# Altium project PortSwitcherPCB1D.PrjPCB
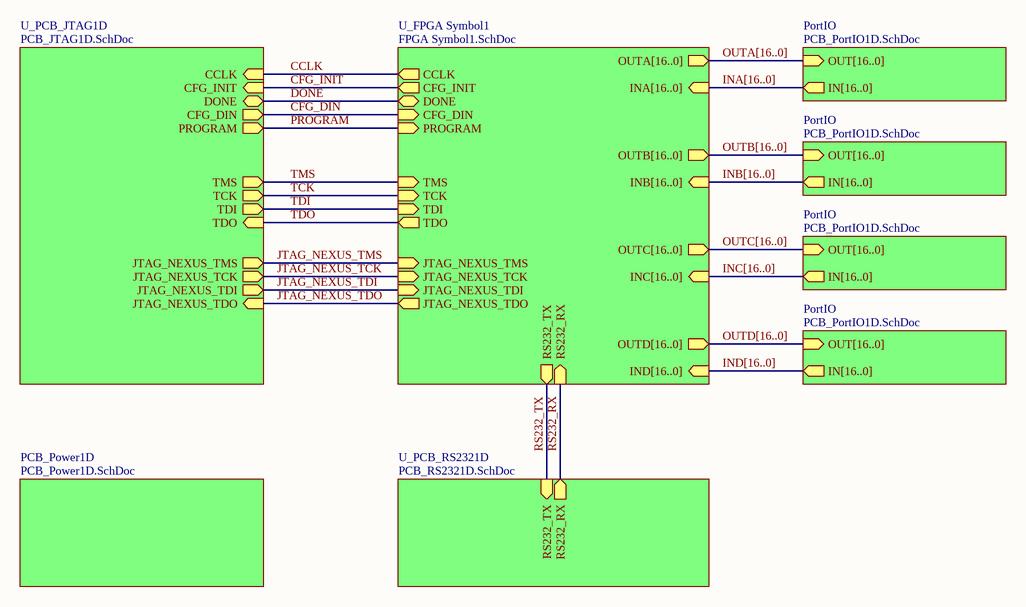
[diagram p0: PCB_PortSwitcher1D.SchDoc]
7 sheets, 152 parts. Net scope: hierarchical (ports join the sheet entries above them; power ports are global).
Board file: PortSwitcher1D.PCBDOC
Sheets:
  PCB_PortSwitcher1D.SchDoc
    PCB_Power1D = PCB_Power1D.SchDoc
    U_PCB_JTAG1D = PCB_JTAG1D.SchDoc
    PortIO = PCB_PortIO1D.SchDoc
    PortIO = PCB_PortIO1D.SchDoc
    PortIO = PCB_PortIO1D.SchDoc
    PortIO = PCB_PortIO1D.SchDoc
    U_FPGA Symbol1 = FPGA Symbol1.SchDoc
      U_FPGA Sheet1 = FPGA Sheet1.SchDoc
    U_PCB_RS2321D = PCB_RS2321D.SchDoc

## Sheet PCB_PortSwitcher1D.SchDoc
size A4; Organization: Altium Limited; Address1: L3, 12a Rodborough Rd; Address2: Frenchs Forest; Address3: NSW; Address4: Australia 2086; DocumentNumber: 1; SheetNumber: 1; SheetTotal: 7

### Sub-sheets
PCB_Power1D = PCB_Power1D.SchDoc: no entries
PortIO = PCB_PortIO1D.SchDoc: OUT[16..0] (in), IN[16..0] (out)
PortIO = PCB_PortIO1D.SchDoc: OUT[16..0] (in), IN[16..0] (out)
PortIO = PCB_PortIO1D.SchDoc: OUT[16..0] (in), IN[16..0] (out)
PortIO = PCB_PortIO1D.SchDoc: OUT[16..0] (in), IN[16..0] (out)
U_FPGA Symbol1 = FPGA Symbol1.SchDoc: CFG_INIT (out), CFG_DIN (in), PROGRAM (in), DONE (bidir), CCLK (out), TMS (in), TCK (in), TDI (in), JTAG_NEXUS_TMS (in), JTAG_NEXUS_TCK (in), JTAG_NEXUS_TDI (in), JTAG_NEXUS_TDO (out), TDO (out), OUTD[16..0] (out), OUTC[16..0] (out), OUTB[16..0] (out), OUTA[16..0] (out), IND[16..0] (in), INC[16..0] (in), INB[16..0] (in), INA[16..0] (in), RS232_TX (out), RS232_RX (in)
U_PCB_JTAG1D = PCB_JTAG1D.SchDoc: TDO (in), TDI (out), TCK (out), TMS (out), DONE (bidir), PROGRAM (out), CCLK (in), JTAG_NEXUS_TMS (out), JTAG_NEXUS_TCK (out), JTAG_NEXUS_TDI (out), JTAG_NEXUS_TDO (in), CFG_DIN (out), CFG_INIT (in)
U_PCB_RS2321D = PCB_RS2321D.SchDoc: RS232_RX (out), RS232_TX (in)

### Nets
CCLK: sheet U_PCB_JTAG1D/CCLK, sheet U_FPGA Symbol1/CCLK
CFG_DIN: sheet U_PCB_JTAG1D/CFG_DIN, sheet U_FPGA Symbol1/CFG_DIN
CFG_INIT: sheet U_PCB_JTAG1D/CFG_INIT, sheet U_FPGA Symbol1/CFG_INIT
DONE: sheet U_PCB_JTAG1D/DONE, sheet U_FPGA Symbol1/DONE
JTAG_NEXUS_TCK: sheet U_PCB_JTAG1D/JTAG_NEXUS_TCK, sheet U_FPGA Symbol1/JTAG_NEXUS_TCK
JTAG_NEXUS_TDI: sheet U_PCB_JTAG1D/JTAG_NEXUS_TDI, sheet U_FPGA Symbol1/JTAG_NEXUS_TDI
JTAG_NEXUS_TDO: sheet U_PCB_JTAG1D/JTAG_NEXUS_TDO, sheet U_FPGA Symbol1/JTAG_NEXUS_TDO
JTAG_NEXUS_TMS: sheet U_PCB_JTAG1D/JTAG_NEXUS_TMS, sheet U_FPGA Symbol1/JTAG_NEXUS_TMS
PROGRAM: sheet U_PCB_JTAG1D/PROGRAM, sheet U_FPGA Symbol1/PROGRAM
RS232_RX: sheet U_FPGA Symbol1/RS232_RX, sheet U_PCB_RS2321D/RS232_RX
RS232_TX: sheet U_FPGA Symbol1/RS232_TX, sheet U_PCB_RS2321D/RS232_TX
TCK: sheet U_PCB_JTAG1D/TCK, sheet U_FPGA Symbol1/TCK
TDI: sheet U_PCB_JTAG1D/TDI, sheet U_FPGA Symbol1/TDI
TDO: sheet U_PCB_JTAG1D/TDO, sheet U_FPGA Symbol1/TDO
TMS: sheet U_PCB_JTAG1D/TMS, sheet U_FPGA Symbol1/TMS

### Buses and harness runs
bus INA[16..0] = sheet PortIO/IN[16..0] = sheet U_FPGA Symbol1/INA[16..0]
bus INB[16..0] = sheet PortIO/IN[16..0] = sheet U_FPGA Symbol1/INB[16..0]
bus INC[16..0] = sheet PortIO/IN[16..0] = sheet U_FPGA Symbol1/INC[16..0]
bus IND[16..0] = sheet PortIO/IN[16..0] = sheet U_FPGA Symbol1/IND[16..0]
bus OUTA[16..0] = sheet PortIO/OUT[16..0] = sheet U_FPGA Symbol1/OUTA[16..0]
bus OUTB[16..0] = sheet PortIO/OUT[16..0] = sheet U_FPGA Symbol1/OUTB[16..0]
bus OUTC[16..0] = sheet PortIO/OUT[16..0] = sheet U_FPGA Symbol1/OUTC[16..0]
bus OUTD[16..0] = sheet PortIO/OUT[16..0] = sheet U_FPGA Symbol1/OUTD[16..0]

### Notes on the sheet
- Title
- Size:
- Date:
- A4
- Number:
- Time:
- Revision:
- Sheet
- of
- File:

## Sheet PCB_Power1D.SchDoc
size A4; Organization: Altium Limited; Address1: L3, 12a Rodborough Rd; Address2: Frenchs Forest; Address3: NSW; Address4: Australia 2086; DocumentNumber: 2; SheetNumber: 2; SheetTotal: 7
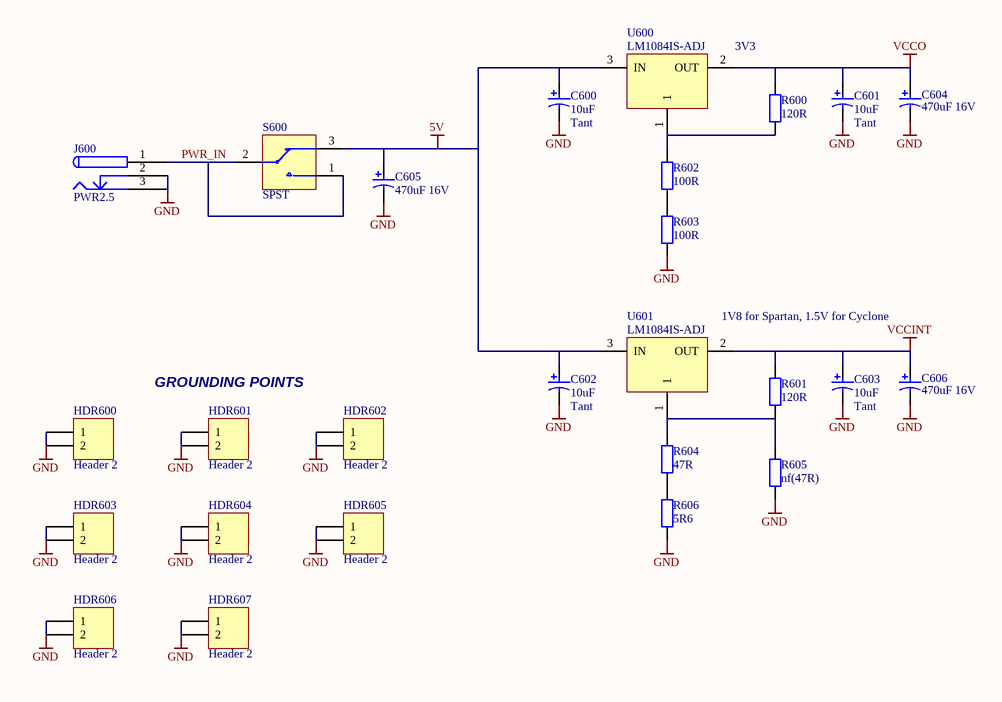
[diagram p1: PCB_Power1D.SchDoc]

### Parts
C600  10uF  Capacitor Type: Tant  [MCCT-B]
C601  10uF  Capacitor Type: Tant  [MCCT-B]
C602  10uF  Capacitor Type: Tant  [MCCT-B]
C603  10uF  Capacitor Type: Tant  [MCCT-B]
C604  470uF 16V  [RB8/3.5]
C605  470uF 16V  [RB8/3.5]
C606  470uF 16V  [RB8/3.5]
HDR600  Header 2  [HDR1X2]
HDR601  Header 2  [HDR1X2]
HDR602  Header 2  [HDR1X2]
HDR603  Header 2  [HDR1X2]
HDR604  Header 2  [HDR1X2]
HDR605  Header 2  [HDR1X2]
HDR606  Header 2  [HDR1X2]
HDR607  Header 2  [HDR1X2]
J600  PWR2.5  [PWR2.5]
R600  120R  [CC2012-0805]
R601  120R  [CC2012-0805]
R602  100R  [CC2012-0805]
R603  100R  [CC2012-0805]
R604  47R  [CC2012-0805]
R605  nf(47R)  [CC2012-0805]
R606  5R6  [CC2012-0805]
S600  SPST  [PCB_SWITCH]
U600  LM1084IS-ADJ  [TO-263]
U601  LM1084IS-ADJ  [TO-263]

### Nets
5V: C600.1 C602.1 C605.1 S600.3 U600.3(IN) U601.3(IN)
GND: C600.2 C601.2 C602.2 C603.2 C604.2 C605.2 C606.2 HDR600.1 HDR600.2 HDR601.1 HDR601.2 HDR602.1 HDR602.2 HDR603.1 HDR603.2 HDR604.1 HDR604.2 HDR605.1 HDR605.2 HDR606.1 HDR606.2 HDR607.1 HDR607.2 J600.2 J600.3 R603.1 R605.1 R606.1
VCCINT: C603.1 C606.1 R601.2 U601.2(OUT)
VCCO: C601.1 C604.1 R600.2 U600.2(OUT)
PWR_IN: J600.1 S600.1 S600.2
NetR600_1: R600.1 R602.2 U600.1
NetR601_1: R601.1 R604.2 R605.2 U601.1
NetR602_1: R602.1 R603.2
NetR604_1: R604.1 R606.2

### Notes on the sheet
- 3V3
- (near U601) 1V8 for Spartan, 1.5V for Cyclone
- (near HDR601) GROUNDING POINTS
- Title
- Size:
- Date:
- A4
- Number:
- Time:
- Revision:
- Sheet
- of
- File:

### Library data of the parts
C600-C606 = CAP_POLAR: Polar Capacitor; Fitted: True
HDR600-HDR607 = Header 2: Header, 2-Pin; Manufacturer: Generic Components; Class I: Connector; Fitted: True; Revision: July-2002: Re-released for DXP Platform.; Publisher: Altium Limited
J600 = PWR2.5: Low Voltage Power Supply Sonnector; Fitted: True
R600-R604 R606 = Res2: Resistor; Manufacturer: Generic Components; Class I: Passive; Published: 8-Jun-2000; Revision: July-2002: Re-released for DXP Platform.; Publisher: Altium Limited; Class II: Resistor
R605 = Res2: Resistor; Manufacturer: Generic Components; Class I: Passive; Fitted: False; Published: 8-Jun-2000; Revision: July-2002: Re-released for DXP Platform.; Publisher: Altium Limited; Class II: Resistor
S600 = PCB_MOUNT_SWITCH: SPDT Subminiature Toggle Switch; Fitted: True
U600 U601 = LM1084IS-ADJ: 5A Low Dropout Possitive Regulators; Fitted: True

## Sheet PCB_JTAG1D.SchDoc
size A4; Organization: Altium Limited; Address1: L3, 12a Rodborough Rd; Address2: Frenchs Forest; Address3: NSW; Address4: Australia 2086; DocumentNumber: 4; SheetNumber: 4; SheetTotal: 7
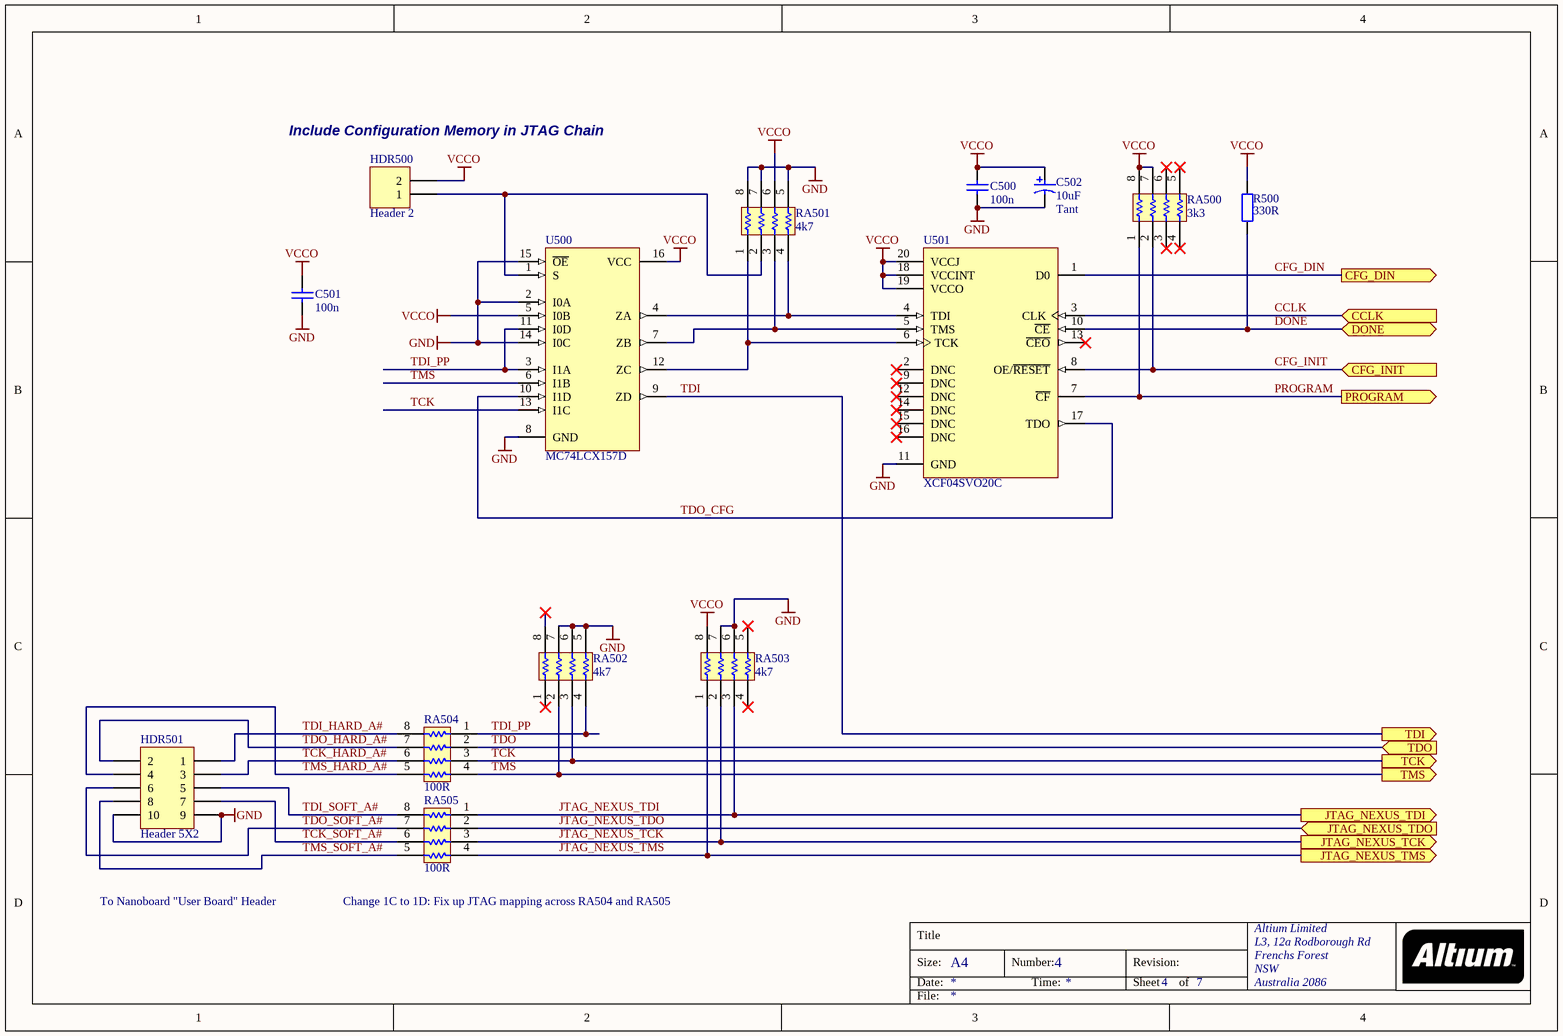
[diagram p2: PCB_JTAG1D.SchDoc]

### Parts
C500  100n  [CC2012-0805]
C501  100n  [CC2012-0805]
C502  10uF  Capacitor Type: Tant  [MCCT-B]
HDR500  Header 2  Usage: Include Configuration Memory in JTAG Chain  [HDR1X2]
HDR501  Header 5X2  Usage: To Nanoboard "User Board" Header  [HDR2X5]
R500  330R  [CC2012-0805]
RA500  3k3  [MNR34]
RA501  4k7  [MNR34]
RA502  4k7  [MNR34]
RA503  4k7  [MNR34]
RA504  100R  [MNR34]
RA505  100R  [MNR34]
U500  MC74LCX157D  [751B-05]
U501  XCF04SVO20C  [VO20]

### Ports
CCLK (in), CFG_DIN (out), CFG_INIT (in), DONE (bidir), JTAG_NEXUS_TCK (out), JTAG_NEXUS_TDI (out), JTAG_NEXUS_TDO (in), JTAG_NEXUS_TMS (out), PROGRAM (out), TCK (out), TDI (out), TDO (in), TMS (out)

### Nets
GND: C500.2 C501.2 C502.2 HDR501.9 HDR501.10 RA501.5 RA501.7 RA501.8 RA502.5 RA502.6 RA502.7 RA503.6 RA503.7 U500.2(I0A) U500.8(GND) U500.14(I0C) U500.15(~{OE}) U501.11(GND)
VCCO: C500.1 C501.1 C502.1 HDR500.2 R500.1 RA500.7 RA500.8 RA501.6 RA503.8 U500.5(I0B) U500.16(VCC) U501.18(VCCINT) U501.19(VCCO) U501.20(VCCJ)
CCLK: U501.3(CLK) ; port CCLK
CFG_DIN: U501.1(D0) ; port CFG_DIN
CFG_INIT: RA500.2 U501.8(OE/~{RESET}) ; port CFG_INIT
DONE: R500.2 U501.10(~{CE}) ; port DONE
JTAG_NEXUS_TCK: RA503.2 RA505.3 ; port JTAG_NEXUS_TCK
JTAG_NEXUS_TDI: RA503.3 RA505.1 ; port JTAG_NEXUS_TDI
JTAG_NEXUS_TDO: RA505.2 ; port JTAG_NEXUS_TDO
JTAG_NEXUS_TMS: RA503.1 RA505.4 ; port JTAG_NEXUS_TMS
PROGRAM: RA500.1 U501.7(~{CF}) ; port PROGRAM
TCK: RA502.3 RA504.3 U500.13(I1C) ; port TCK
TCK_HARD_A#: HDR501.3 RA504.6
TCK_SOFT_A#: HDR501.7 RA505.6
TDI: U500.9(ZD) ; port TDI
TDI_HARD_A#: HDR501.1 RA504.8
TDI_PP: RA502.4 RA504.1 U500.3(I1A) U500.11(I0D)
TDI_SOFT_A#: HDR501.5 RA505.8
TDO: RA504.2 ; port TDO
TDO_CFG: U500.10(I1D) U501.17(TDO)
TDO_HARD_A#: HDR501.2 RA504.7
TDO_SOFT_A#: HDR501.6 RA505.7
TMS: RA502.2 RA504.4 U500.6(I1B) ; port TMS
TMS_HARD_A#: HDR501.4 RA504.5
TMS_SOFT_A#: HDR501.8 RA505.5
NetHDR500_1: HDR500.1 RA501.2 U500.1(S)
NetRA501_1: RA501.1 U500.12(ZC) U501.6(TCK)
NetRA501_3: RA501.3 U500.7(ZB) U501.5(TMS)
NetRA501_4: RA501.4 U500.4(ZA) U501.4(TDI)

Not connected (* = marked no-connect by the designer): RA500 3* 4* 5* 6*; RA502 1* 8*; RA503 4* 5*; U501 2(DNC)* 9(DNC)* 12(DNC)* 13(~{CEO})* 14(DNC)* 15(DNC)* 16(DNC)*

### Notes on the sheet
- (near RA505) Change 1C to 1D: Fix up JTAG mapping across RA504 and RA505
- Title
- Size:
- Date:
- A4
- Number:
- Time:
- Revision:
- Sheet
- of
- File:

### Library data of the parts
C500 C501 = CAP: Capacitor; Fitted: True
C502 = CAP_POLAR: Polar Capacitor; Fitted: True
HDR500 = Header 2: Header, 2-Pin; Manufacturer: Generic Components; Class I: Connector; Fitted: False; Revision: July-2002: Re-released for DXP Platform.; Publisher: Altium Limited
HDR501 = Header 5X2: Header, 5-Pin, Dual row; Manufacturer: Generic Components; Class I: Connector; Fitted: True; Revision: July-2002: Re-released for DXP Platform.; Publisher: Altium Limited
R500 = Res2: as R600 on sheet PCB_Power1D; Published: 8-Jun-2000; Revision: July-2002: Re-released for DXP Platform.; Publisher: Altium Limited; Class II: Resistor
RA500-RA505 = MNR34: 3216x4 Resistor Array; Fitted: True
U500 = MC74LCX157D: Low-Voltage Quad 2-Input Multiplexer with 5V-Tolerant Inputs (Non-Inverting); Manufacturer: ON Semiconductor; Package Information: Latest Revision: Oct-1999; Code - JEDEC: MS-012-AC; Code - IPC: SO16; Published: 15-Apr-2002; Datasheet: Latest Revision: 1997; Package Reference: 751B-05; Publisher: Altium Limited
U501 = XCF04SVO20C: XCF00S Series, Platform Flash In-System Programmable Configuration 3.3V PROM, 20-Pin TSOP, 4-Megabit, Commercial Grade; Manufacturer: Xilinx; Package Information: Latest Revision: ver1.0, May-2003; Code - JEDEC: MO-153-AC; Published: 17-Sep-2003; Datasheet: Latest Revision: ver1.1, Jun-2003; Package Reference: VO20; Publisher: Altium Limited

## Sheet PCB_PortIO1D.SchDoc
size A4; Organization: Altium Limited; Address1: L3, 12a Rodborough Rd; Address2: Frenchs Forest; Address3: NSW; Address4: Australia 2086; DocumentNumber: 7; SheetNumber: 7; SheetTotal: 7
Used 4 times, as channels PortIO, PortIO, PortIO, PortIO. Parts and nets are listed once, with the designators drawn on the sheet.
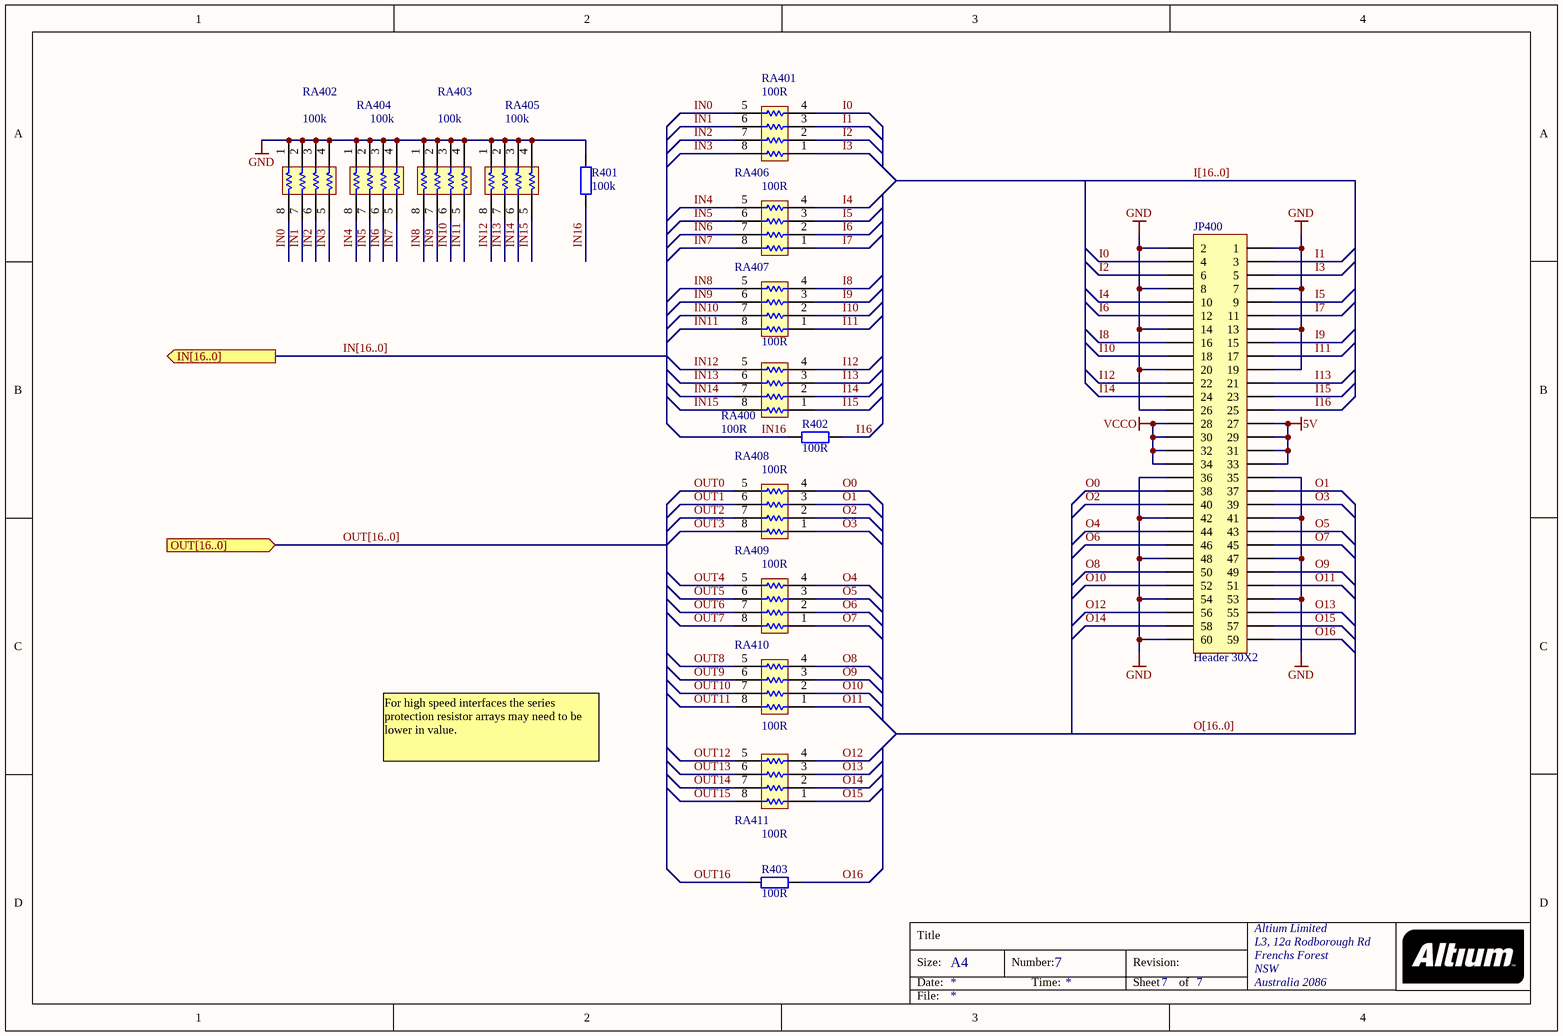
[diagram p3: PCB_PortIO1D.SchDoc]

### Parts
JP400  Header 30X2  [HDR2X30]
R401  100k  [CC2012-0805]
R402  100R  [CC2012-0805]
R403  100R  [CC2012-0805]
RA400  100R  [MNR34]
RA401  100R  [MNR34]
RA402  100k  [MNR34]
RA403  100k  [MNR34]
RA404  100k  [MNR34]
RA405  100k  [MNR34]
RA406  100R  [MNR34]
RA407  100R  [MNR34]
RA408  100R  [MNR34]
RA409  100R  [MNR34]
RA410  100R  [MNR34]
RA411  100R  [MNR34]

### Ports
IN[16..0] (out), OUT[16..0] (in)

### Nets
5V: JP400.27 JP400.29 JP400.31 JP400.33
GND: JP400.1 JP400.2 JP400.7 JP400.8 JP400.13 JP400.14 JP400.19 JP400.20 JP400.26 JP400.35 JP400.36 JP400.41 JP400.42 JP400.47 JP400.48 JP400.53 JP400.54 JP400.60 R401.1 RA402.1 RA402.2 RA402.3 RA402.4 RA403.1 RA403.2 RA403.3 RA403.4 RA404.1 RA404.2 RA404.3 RA404.4 RA405.1 RA405.2 RA405.3 RA405.4
VCCO: JP400.28 JP400.30 JP400.32 JP400.34
I0: JP400.4 RA401.4
I1: JP400.3 RA401.3
I2: JP400.6 RA401.2
I3: JP400.5 RA401.1
I4: JP400.10 RA406.4
I5: JP400.9 RA406.3
I6: JP400.12 RA406.2
I7: JP400.11 RA406.1
I8: JP400.16 RA407.4
I9: JP400.15 RA407.3
I10: JP400.18 RA407.2
I11: JP400.17 RA407.1
I12: JP400.22 RA400.4
I13: JP400.21 RA400.3
I14: JP400.24 RA400.2
I15: JP400.23 RA400.1
I16: JP400.25 R402.2
IN0: RA401.5 RA402.8
IN1: RA401.6 RA402.7
IN2: RA401.7 RA402.6
IN3: RA401.8 RA402.5
IN4: RA404.8 RA406.5
IN5: RA404.7 RA406.6
IN6: RA404.6 RA406.7
IN7: RA404.5 RA406.8
IN8: RA403.8 RA407.5
IN9: RA403.7 RA407.6
IN10: RA403.6 RA407.7
IN11: RA403.5 RA407.8
IN12: RA400.5 RA405.8
IN13: RA400.6 RA405.7
IN14: RA400.7 RA405.6
IN15: RA400.8 RA405.5
IN16: R401.2 R402.1
O0: JP400.38 RA408.4
O1: JP400.37 RA408.3
O2: JP400.40 RA408.2
O3: JP400.39 RA408.1
O4: JP400.44 RA409.4
O5: JP400.43 RA409.3
O6: JP400.46 RA409.2
O7: JP400.45 RA409.1
O8: JP400.50 RA410.4
O9: JP400.49 RA410.3
O10: JP400.52 RA410.2
O11: JP400.51 RA410.1
O12: JP400.56 RA411.4
O13: JP400.55 RA411.3
O14: JP400.58 RA411.2
O15: JP400.57 RA411.1
O16: JP400.59 R403.2
OUT0: RA408.5
OUT1: RA408.6
OUT2: RA408.7
OUT3: RA408.8
OUT4: RA409.5
OUT5: RA409.6
OUT6: RA409.7
OUT7: RA409.8
OUT8: RA410.5
OUT9: RA410.6
OUT10: RA410.7
OUT11: RA410.8
OUT12: RA411.5
OUT13: RA411.6
OUT14: RA411.7
OUT15: RA411.8
OUT16: R403.1

### Channels
PortIO: designators end in _PortIOD
PortIO: designators end in _PortIOC
PortIO: designators end in _PortIOB
PortIO: designators end in _PortIOA

### Buses and harness runs
bus I[16..0]
bus IN[16..0] = port IN[16..0]
bus O[16..0]
bus OUT[16..0] = port OUT[16..0]

### Notes on the sheet
- For high speed interfaces the series protection resistor arrays may need to be lower in value.
- Title
- Size:
- Date:
- A4
- Number:
- Time:
- Revision:
- Sheet
- of
- File:

### Library data of the parts
JP400 = Header 30X2: Header, 30-Pin, Dual row; Manufacturer: Generic Components; Class I: Connector; Revision: July-2002: Re-released for DXP Platform.; Publisher: Altium Limited
R401-R403 = Res2: as R600 on sheet PCB_Power1D; Published: 8-Jun-2000; Revision: July-2002: Re-released for DXP Platform.; Publisher: Altium Limited; Class II: Resistor
RA400-RA411 = MNR34: 3216x4 Resistor Array; Fitted: True

## Sheet FPGA Symbol1.SchDoc
size A4; Organization: Altium Limited; Address1: L3, 12a Rodborough Rd; Address2: Frenchs Forest; Address3: NSW; Address4: Australia 2086; DocumentNumber: 6; SheetNumber: 6; SheetTotal: 7
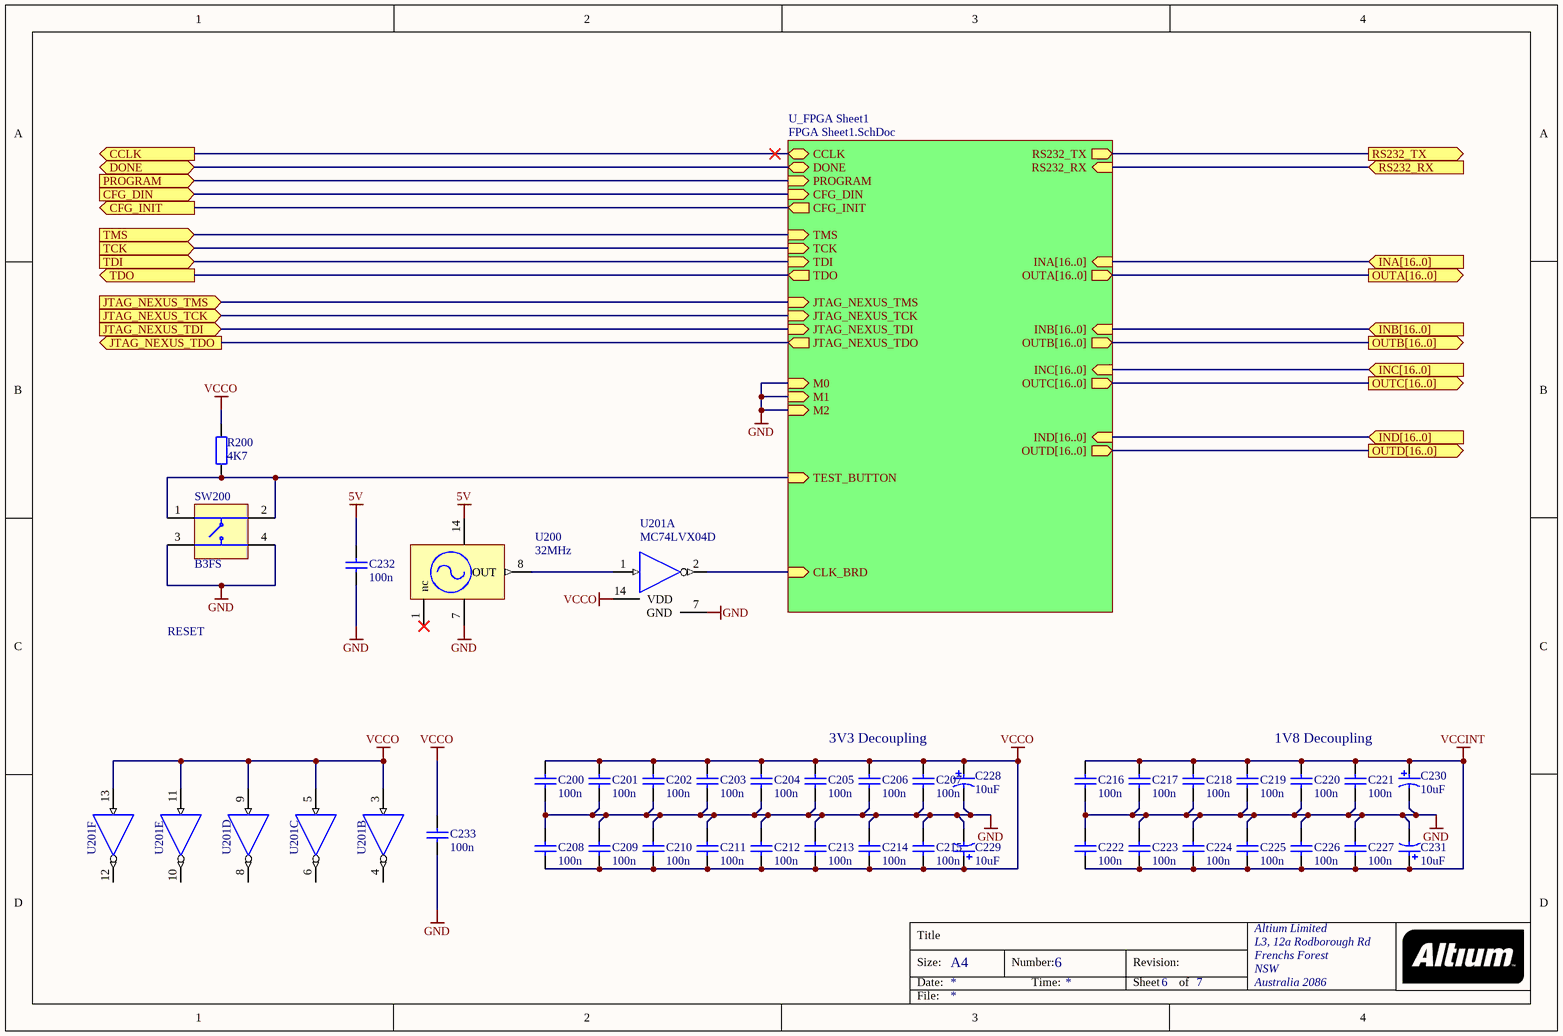
[diagram p4: FPGA Symbol1.SchDoc]

### Parts
C200  100n  [CC2012-0805]
C201  100n  [CC2012-0805]
C202  100n  [CC2012-0805]
C203  100n  [CC2012-0805]
C204  100n  [CC2012-0805]
C205  100n  [CC2012-0805]
C206  100n  [CC2012-0805]
C207  100n  [CC2012-0805]
C208  100n  [CC2012-0805]
C209  100n  [CC2012-0805]
C210  100n  [CC2012-0805]
C211  100n  [CC2012-0805]
C212  100n  [CC2012-0805]
C213  100n  [CC2012-0805]
C214  100n  [CC2012-0805]
C215  100n  [CC2012-0805]
C216  100n  [CC2012-0805]
C217  100n  [CC2012-0805]
C218  100n  [CC2012-0805]
C219  100n  [CC2012-0805]
C220  100n  [CC2012-0805]
C221  100n  [CC2012-0805]
C222  100n  [CC2012-0805]
C223  100n  [CC2012-0805]
C224  100n  [CC2012-0805]
C225  100n  [CC2012-0805]
C226  100n  [CC2012-0805]
C227  100n  [CC2012-0805]
C228  10uF  [MCCT-B]
C229  10uF  [MCCT-B]
C230  10uF  [MCCT-B]
C231  10uF  [MCCT-B]
C232  100n  [CC2012-0805]
C233  100n  [CC2012-0805]
R200  4K7  [CC2012-0805]
SW200  B3FS  [B3FS_SWITCH]
U200  32MHz  [XO600CP]
U201  MC74LVX04D  [751A-03]  (parts A,B,C,D,E,F of 6)

### Sub-sheets
U_FPGA Sheet1 = FPGA Sheet1.SchDoc: CFG_DIN (in), CFG_INIT (out), CLK_BRD (in), INA[16..0] (in), INC[16..0] (in), JTAG_NEXUS_TCK (in), JTAG_NEXUS_TDI (in), JTAG_NEXUS_TDO (out), JTAG_NEXUS_TMS (in), OUTA[16..0] (out), OUTB[16..0] (out), OUTC[16..0] (out), OUTD[16..0] (out), RS232_RX (in), RS232_TX (out), TEST_BUTTON (in), CCLK (bidir), DONE (bidir), M0 (in), M1 (in), M2 (in), PROGRAM (in), TCK (in), TDI (in), TDO (out), TMS (in), INB[16..0] (in), IND[16..0] (in)

### Ports
CCLK (out), CFG_DIN (in), CFG_INIT (out), DONE (bidir), INA[16..0] (in), INB[16..0] (in), INC[16..0] (in), IND[16..0] (in), JTAG_NEXUS_TCK (in), JTAG_NEXUS_TDI (in), JTAG_NEXUS_TDO (out), JTAG_NEXUS_TMS (in), OUTA[16..0] (out), OUTB[16..0] (out), OUTC[16..0] (out), OUTD[16..0] (out), PROGRAM (in), RS232_RX (in), RS232_TX (out), TCK (in), TDI (in), TDO (out), TMS (in)

### Nets
5V: C232.1 U200.14(VCC)
GND: C200.2 C201.2 C202.2 C203.2 C204.2 C205.2 C206.2 C207.2 C208.1 C209.1 C210.1 C211.1 C212.1 C213.1 C214.1 C215.1 C216.2 C217.2 C218.2 C219.2 C220.2 C221.2 C222.1 C223.1 C224.1 C225.1 C226.1 C227.1 C228.2 C229.2 C230.2 C231.2 C232.2 C233.2 SW200.3 SW200.4 U200.7(GND) U201.7(GND) ; sheet U_FPGA Sheet1/M0, sheet U_FPGA Sheet1/M1, sheet U_FPGA Sheet1/M2
VCCINT: C216.1 C217.1 C218.1 C219.1 C220.1 C221.1 C222.2 C223.2 C224.2 C225.2 C226.2 C227.2 C230.1 C231.1
VCCO: C200.1 C201.1 C202.1 C203.1 C204.1 C205.1 C206.1 C207.1 C208.2 C209.2 C210.2 C211.2 C212.2 C213.2 C214.2 C215.2 C228.1 C229.1 C233.1 R200.2 U201.3(IN) U201.5(IN) U201.9(IN) U201.11(IN) U201.13(IN) U201.14(VDD)
CCLK: port CCLK, sheet U_FPGA Sheet1/CCLK
CFG_DIN: port CFG_DIN, sheet U_FPGA Sheet1/CFG_DIN
CFG_INIT: port CFG_INIT, sheet U_FPGA Sheet1/CFG_INIT
CLK_BRD: U201.2(~{OUT}) ; sheet U_FPGA Sheet1/CLK_BRD
DONE: port DONE, sheet U_FPGA Sheet1/DONE
JTAG_NEXUS_TCK: port JTAG_NEXUS_TCK, sheet U_FPGA Sheet1/JTAG_NEXUS_TCK
JTAG_NEXUS_TDI: port JTAG_NEXUS_TDI, sheet U_FPGA Sheet1/JTAG_NEXUS_TDI
JTAG_NEXUS_TDO: port JTAG_NEXUS_TDO, sheet U_FPGA Sheet1/JTAG_NEXUS_TDO
JTAG_NEXUS_TMS: port JTAG_NEXUS_TMS, sheet U_FPGA Sheet1/JTAG_NEXUS_TMS
PROGRAM: port PROGRAM, sheet U_FPGA Sheet1/PROGRAM
RS232_RX: port RS232_RX, sheet U_FPGA Sheet1/RS232_RX
RS232_TX: port RS232_TX, sheet U_FPGA Sheet1/RS232_TX
TCK: port TCK, sheet U_FPGA Sheet1/TCK
TDI: port TDI, sheet U_FPGA Sheet1/TDI
TDO: port TDO, sheet U_FPGA Sheet1/TDO
TEST_BUTTON: R200.1 SW200.1 SW200.2 ; sheet U_FPGA Sheet1/TEST_BUTTON
TMS: port TMS, sheet U_FPGA Sheet1/TMS
NetU200_8: U200.8(OUT) U201.1(IN)

Not connected (* = marked no-connect by the designer): U200 1(nc)*; U201 4(~{OUT}) 6(~{OUT}) 8(~{OUT}) 10(~{OUT}) 12(~{OUT})

### Buses and harness runs
bus port INA[16..0] = sheet U_FPGA Sheet1/INA[16..0]
bus port INB[16..0] = sheet U_FPGA Sheet1/INB[16..0]
bus port INC[16..0] = sheet U_FPGA Sheet1/INC[16..0]
bus port IND[16..0] = sheet U_FPGA Sheet1/IND[16..0]
bus port OUTA[16..0] = sheet U_FPGA Sheet1/OUTA[16..0]
bus port OUTB[16..0] = sheet U_FPGA Sheet1/OUTB[16..0]
bus port OUTC[16..0] = sheet U_FPGA Sheet1/OUTC[16..0]
bus port OUTD[16..0] = sheet U_FPGA Sheet1/OUTD[16..0]

### Notes on the sheet
- RESET
- 3V3 Decoupling
- 1V8 Decoupling
- Title
- Size:
- Date:
- A4
- Number:
- Time:
- Revision:
- Sheet
- of
- File:

### Library data of the parts
C200-C227 C232 C233 = CAP: Capacitor; Fitted: True
C228-C231 = CAP_POLAR: Polar Capacitor
  C229-C231: Supplier: FARNELL; Supplier Code: 967-117
R200 = Res2: as R600 on sheet PCB_Power1D; Published: 8-Jun-2000; Revision: July-2002: Re-released for DXP Platform.; Publisher: Altium Limited; Class II: Resistor
SW200 = B3FS: SPNA SMD Keyboard Switch; Fitted: True
U200 = XO_CAN_DIP14_1M: IC, Oscillator, Canned, CMOS o/p, General Purpose, No Enable/Disable, 32MHz; Text Field1: TBA
U201 = MC74LVX04D: Hex Inverter with 5V-Tolerant Inputs; Manufacturer: ON Semiconductor; Code - JEDEC: MS-012-AB; Code - IPC: SO14; Published: 15-Apr-2002; Datasheet: Latest Revision: 1997; Package Reference: 751A-03; Publisher: Altium Limited

## Sheet FPGA Sheet1.SchDoc
size A2; Generated From FPGA Project: PortSwitcherFPGA1C.PrjFpg; UNUSED_SPECIAL: RouteSeparate; UNUSED_IO: NoERC; VREF: NoERC; UNUSED_INPUT: NoERC; DocumentNumber: 5; SheetNumber: 5; SheetTotal: 7
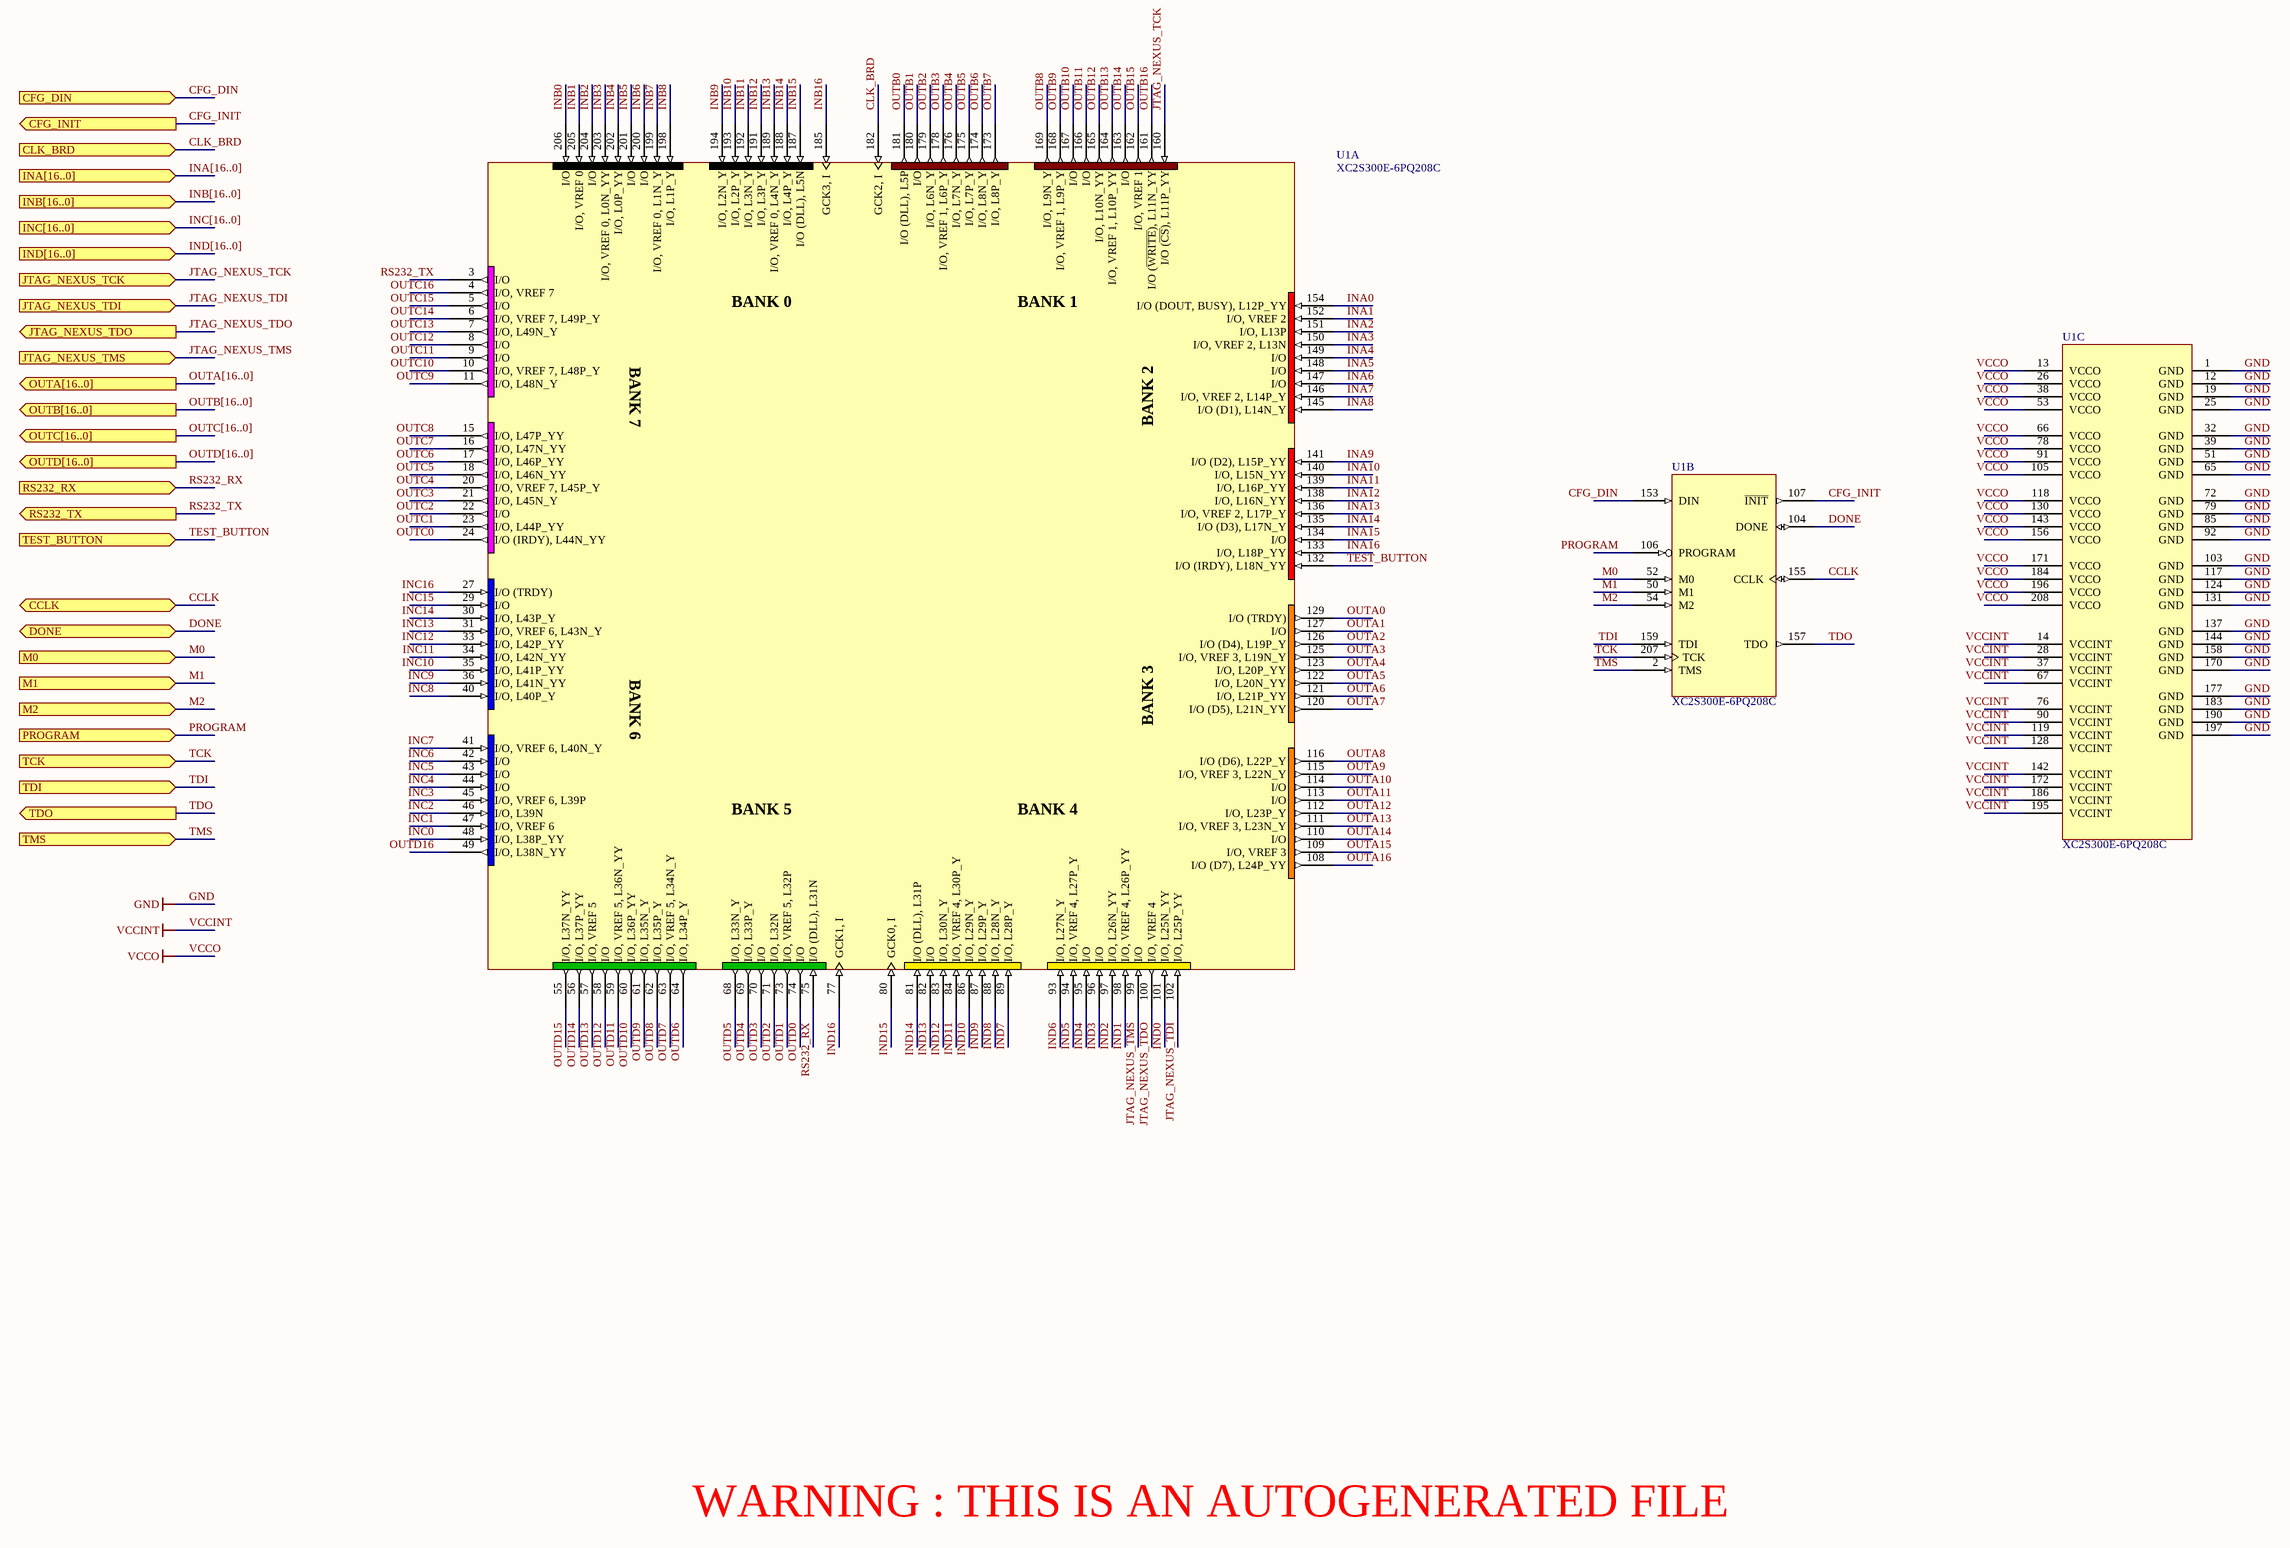
[diagram p5: FPGA Sheet1.SchDoc]

### Parts
U1  XC2S300E-6PQ208C  [PQ208]  (parts A,B,C of 3)

### Ports
CCLK (bidir), CFG_DIN (in), CFG_INIT (out), CLK_BRD (in), DONE (bidir), INA[16..0] (in), INB[16..0] (in), INC[16..0] (in), IND[16..0] (in), JTAG_NEXUS_TCK (in), JTAG_NEXUS_TDI (in), JTAG_NEXUS_TDO (out), JTAG_NEXUS_TMS (in), M0 (in), M1 (in), M2 (in), OUTA[16..0] (out), OUTB[16..0] (out), OUTC[16..0] (out), OUTD[16..0] (out), PROGRAM (in), RS232_RX (in), RS232_TX (out), TCK (in), TDI (in), TDO (out), TEST_BUTTON (in), TMS (in)

### Nets
GND: U1.1(GND) U1.12(GND) U1.19(GND) U1.25(GND) U1.32(GND) U1.39(GND) U1.50(M1) U1.51(GND) U1.52(M0) U1.54(M2) U1.65(GND) U1.72(GND) U1.79(GND) U1.85(GND) U1.92(GND) U1.103(GND) U1.117(GND) U1.124(GND) U1.131(GND) U1.137(GND) U1.144(GND) U1.158(GND) U1.170(GND) U1.177(GND) U1.183(GND) U1.190(GND) U1.197(GND) ; port M0, port M1, port M2  [also labelled M0, M1, M2]
VCCINT: U1.14(VCCINT) U1.28(VCCINT) U1.37(VCCINT) U1.67(VCCINT) U1.76(VCCINT) U1.90(VCCINT) U1.119(VCCINT) U1.128(VCCINT) U1.142(VCCINT) U1.172(VCCINT) U1.186(VCCINT) U1.195(VCCINT)
VCCO: U1.13(VCCO) U1.26(VCCO) U1.38(VCCO) U1.53(VCCO) U1.66(VCCO) U1.78(VCCO) U1.91(VCCO) U1.105(VCCO) U1.118(VCCO) U1.130(VCCO) U1.143(VCCO) U1.156(VCCO) U1.171(VCCO) U1.184(VCCO) U1.196(VCCO) U1.208(VCCO)
CCLK: U1.155(CCLK) ; port CCLK
CFG_DIN: U1.153(DIN) ; port CFG_DIN
CFG_INIT: U1.107(~{INIT}) ; port CFG_INIT
CLK_BRD: U1.182(GCK2,_I) ; port CLK_BRD
DONE: U1.104(DONE) ; port DONE
INA0: U1.154(I/O_(DOUT,_BUSY),_L12P_YY)
INA1: U1.152(I/O,_VREF_2)
INA2: U1.151(I/O,_L13P)
INA3: U1.150(I/O,_VREF_2,_L13N)
INA4: U1.149(I/O)
INA5: U1.148(I/O)
INA6: U1.147(I/O)
INA7: U1.146(I/O,_VREF_2,_L14P_Y)
INA8: U1.145(I/O_(D1),_L14N_Y)
INA9: U1.141(I/O_(D2),_L15P_YY)
INA10: U1.140(I/O,_L15N_YY)
INA11: U1.139(I/O,_L16P_YY)
INA12: U1.138(I/O,_L16N_YY)
INA13: U1.136(I/O,_VREF_2,_L17P_Y)
INA14: U1.135(I/O_(D3),_L17N_Y)
INA15: U1.134(I/O)
INA16: U1.133(I/O,_L18P_YY)
INB0: U1.206(I/O)
INB1: U1.205(I/O,_VREF_0)
INB2: U1.204(I/O)
INB3: U1.203(I/O,_VREF_0,_L0N_YY)
INB4: U1.202(I/O,_L0P_YY)
INB5: U1.201(I/O)
INB6: U1.200(I/O)
INB7: U1.199(I/O,_VREF_0,_L1N_Y)
INB8: U1.198(I/O,_L1P_Y)
INB9: U1.194(I/O,_L2N_Y)
INB10: U1.193(I/O,_L2P_Y)
INB11: U1.192(I/O,_L3N_Y)
INB12: U1.191(I/O,_L3P_Y)
INB13: U1.189(I/O,_VREF_0,_L4N_Y)
INB14: U1.188(I/O,_L4P_Y)
INB15: U1.187(I/O_(DLL),_L5N)
INB16: U1.185(GCK3,_I)
INC0: U1.48(I/O,_L38P_YY)
INC1: U1.47(I/O,_VREF_6)
INC2: U1.46(I/O,_L39N)
INC3: U1.45(I/O,_VREF_6,_L39P)
INC4: U1.44(I/O)
INC5: U1.43(I/O)
INC6: U1.42(I/O)
INC7: U1.41(I/O,_VREF_6,_L40N_Y)
INC8: U1.40(I/O,_L40P_Y)
INC9: U1.36(I/O,_L41N_YY)
INC10: U1.35(I/O,_L41P_YY)
INC11: U1.34(I/O,_L42N_YY)
INC12: U1.33(I/O,_L42P_YY)
INC13: U1.31(I/O,_VREF_6,_L43N_Y)
INC14: U1.30(I/O,_L43P_Y)
INC15: U1.29(I/O)
INC16: U1.27(I/O_(TRDY))
IND0: U1.101(I/O,_L25N_YY)
IND1: U1.98(I/O,_VREF_4,_L26P_YY)
IND2: U1.97(I/O,_L26N_YY)
IND3: U1.96(I/O)
IND4: U1.95(I/O)
IND5: U1.94(I/O,_VREF_4,_L27P_Y)
IND6: U1.93(I/O,_L27N_Y)
IND7: U1.89(I/O,_L28P_Y)
IND8: U1.88(I/O,_L28N_Y)
IND9: U1.87(I/O,_L29P_Y)
IND10: U1.86(I/O,_L29N_Y)
IND11: U1.84(I/O,_VREF_4,_L30P_Y)
IND12: U1.83(I/O,_L30N_Y)
IND13: U1.82(I/O)
IND14: U1.81(I/O_(DLL),_L31P)
IND15: U1.80(GCK0,_I)
IND16: U1.77(GCK1,_I)
JTAG_NEXUS_TCK: U1.160(I/O_(~{CS}),_L11P_YY) ; port JTAG_NEXUS_TCK
JTAG_NEXUS_TDI: U1.102(I/O,_L25P_YY) ; port JTAG_NEXUS_TDI
JTAG_NEXUS_TDO: U1.100(I/O,_VREF_4) ; port JTAG_NEXUS_TDO
JTAG_NEXUS_TMS: U1.99(I/O) ; port JTAG_NEXUS_TMS
OUTA0: U1.129(I/O_(TRDY))
OUTA1: U1.127(I/O)
OUTA2: U1.126(I/O_(D4),_L19P_Y)
OUTA3: U1.125(I/O,_VREF_3,_L19N_Y)
OUTA4: U1.123(I/O,_L20P_YY)
OUTA5: U1.122(I/O,_L20N_YY)
OUTA6: U1.121(I/O,_L21P_YY)
OUTA7: U1.120(I/O_(D5),_L21N_YY)
OUTA8: U1.116(I/O_(D6),_L22P_Y)
OUTA9: U1.115(I/O,_VREF_3,_L22N_Y)
OUTA10: U1.114(I/O)
OUTA11: U1.113(I/O)
OUTA12: U1.112(I/O,_L23P_Y)
OUTA13: U1.111(I/O,_VREF_3,_L23N_Y)
OUTA14: U1.110(I/O)
OUTA15: U1.109(I/O,_VREF_3)
OUTA16: U1.108(I/O_(D7),_L24P_YY)
OUTB0: U1.181(I/O_(DLL),_L5P)
OUTB1: U1.180(I/O)
OUTB2: U1.179(I/O,_L6N_Y)
OUTB3: U1.178(I/O,_VREF_1,_L6P_Y)
OUTB4: U1.176(I/O,_L7N_Y)
OUTB5: U1.175(I/O,_L7P_Y)
OUTB6: U1.174(I/O,_L8N_Y)
OUTB7: U1.173(I/O,_L8P_Y)
OUTB8: U1.169(I/O,_L9N_Y)
OUTB9: U1.168(I/O,_VREF_1,_L9P_Y)
OUTB10: U1.167(I/O)
OUTB11: U1.166(I/O)
OUTB12: U1.165(I/O,_L10N_YY)
OUTB13: U1.164(I/O,_VREF_1,_L10P_YY)
OUTB14: U1.163(I/O)
OUTB15: U1.162(I/O,_VREF_1)
OUTB16: U1.161(I/O_(~{WRITE}),_L11N_YY)
OUTC0: U1.24(I/O_(IRDY),_L44N_YY)
OUTC1: U1.23(I/O,_L44P_YY)
OUTC2: U1.22(I/O)
OUTC3: U1.21(I/O,_L45N_Y)
OUTC4: U1.20(I/O,_VREF_7,_L45P_Y)
OUTC5: U1.18(I/O,_L46N_YY)
OUTC6: U1.17(I/O,_L46P_YY)
OUTC7: U1.16(I/O,_L47N_YY)
OUTC8: U1.15(I/O,_L47P_YY)
OUTC9: U1.11(I/O,_L48N_Y)
OUTC10: U1.10(I/O,_VREF_7,_L48P_Y)
OUTC11: U1.9(I/O)
OUTC12: U1.8(I/O)
OUTC13: U1.7(I/O,_L49N_Y)
OUTC14: U1.6(I/O,_VREF_7,_L49P_Y)
OUTC15: U1.5(I/O)
OUTC16: U1.4(I/O,_VREF_7)
OUTD0: U1.74(I/O)
OUTD1: U1.73(I/O,_VREF_5,_L32P)
OUTD2: U1.71(I/O,_L32N)
OUTD3: U1.70(I/O)
OUTD4: U1.69(I/O,_L33P_Y)
OUTD5: U1.68(I/O,_L33N_Y)
OUTD6: U1.64(I/O,_L34P_Y)
OUTD7: U1.63(I/O,_VREF_5,_L34N_Y)
OUTD8: U1.62(I/O,_L35P_Y)
OUTD9: U1.61(I/O,_L35N_Y)
OUTD10: U1.60(I/O,_L36P_YY)
OUTD11: U1.59(I/O,_VREF_5,_L36N_YY)
OUTD12: U1.58(I/O)
OUTD13: U1.57(I/O,_VREF_5)
OUTD14: U1.56(I/O,_L37P_YY)
OUTD15: U1.55(I/O,_L37N_YY)
OUTD16: U1.49(I/O,_L38N_YY)
PROGRAM: U1.106(PROGRAM) ; port PROGRAM
RS232_RX: U1.75(I/O_(DLL),_L31N) ; port RS232_RX
RS232_TX: U1.3(I/O) ; port RS232_TX
TCK: U1.207(TCK) ; port TCK
TDI: U1.159(TDI) ; port TDI
TDO: U1.157(TDO) ; port TDO
TEST_BUTTON: U1.132(I/O_(IRDY),_L18N_YY) ; port TEST_BUTTON
TMS: U1.2(TMS) ; port TMS

### Buses and harness runs
bus INA[16..0] = port INA[16..0]
bus INB[16..0] = port INB[16..0]
bus INC[16..0] = port INC[16..0]
bus IND[16..0] = port IND[16..0]
bus OUTA[16..0] = port OUTA[16..0]
bus OUTB[16..0] = port OUTB[16..0]
bus OUTC[16..0] = port OUTC[16..0]
bus OUTD[16..0] = port OUTD[16..0]

### Notes on the sheet
- WARNING : THIS IS AN AUTOGENERATED FILE
- (in symbol XC2S300E-6PQ208C, part A) BANK 0; BANK 1; BANK 7; BANK 2; BANK 6; BANK 3; BANK 5; BANK 4

### Library data of the parts
U1 = XC2S300E-6PQ208C: Spartan-IIE 1.8V FPGA, 208-Pin PQFP, Standard Performance, Commercial Grade; Package Information: Latest Revision: ver1.1, Oct-2002; Code - JEDEC: MS-029-FA-1; Published: 19-Jul-2002; Revision: 17-Sep-2003: Pin names updated to match datasheet, ver2.1.; Datasheet: Latest Revision: 09-Jul-2003; Package Reference: PQ208; Publisher: Altium Limited

## Sheet PCB_RS2321D.SchDoc
size A4; Organization: Altium Limited; Address1: L3, 12a Rodborough Rd; Address2: Frenchs Forest; Address3: NSW; Address4: Australia 2086; DocumentNumber: 3; SheetNumber: 3; SheetTotal: 7
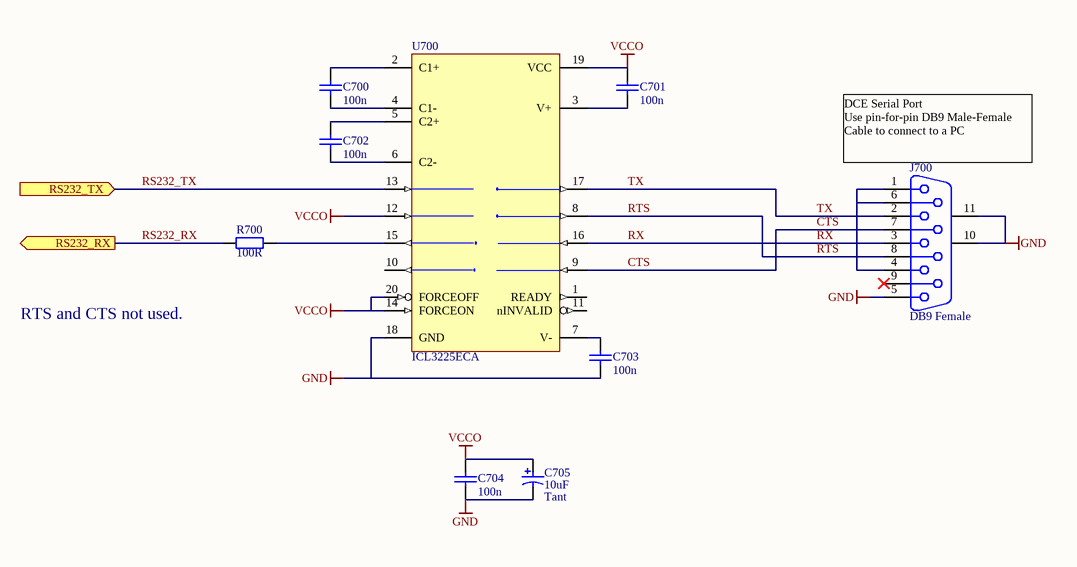
[diagram p6: PCB_RS2321D.SchDoc]

### Parts
C700  100n  [CC2012-0805]
C701  100n  [CC2012-0805]
C702  100n  [CC2012-0805]
C703  100n  [CC2012-0805]
C704  100n  [CC2012-0805]
C705  10uF  Capacitor Type: Tant  [MCCT-B]
J700  DB9 Female  [DSUB1.385-2H9]
R700  100R  [CC2012-0805]
U700  ICL3225ECA  [SSO-G20/P.65]

### Ports
RS232_RX (out), RS232_TX (in)

### Nets
GND: C703.2 C704.2 C705.2 J700.5 J700.10(MH1) J700.11(MH2) U700.18(GND)
VCCO: C701.1 C704.1 C705.1 U700.12(T2IN) U700.14(FORCEON) U700.19(VCC) U700.20(FORCEOFF)
CTS: J700.7 U700.9(R2IN)
RS232_RX: R700.2 ; port RS232_RX
RS232_TX: U700.13(T1IN) ; port RS232_TX
RTS: J700.8 U700.8(T2OUT)
RX: J700.3 U700.16(R1IN)
TX: J700.2 U700.17(T1OUT)
NetC700_1: C700.1 U700.2(C1+)
NetC700_2: C700.2 U700.4(C1-)
NetC701_2: C701.2 U700.3(V+)
NetC702_1: C702.1 U700.5(C2+)
NetC702_2: C702.2 U700.6(C2-)
NetC703_1: C703.1 U700.7(V-)
NetJ700_1: J700.1 J700.4 J700.6
NetR700_1: R700.1 U700.15(R1OUT)

Not connected (* = marked no-connect by the designer): J700 9*; U700 1(READY) 10(R2OUT) 11(nINVALID)

### Notes on the sheet
- (near J700) DCE Serial Port
  Use pin-for-pin DB9 Male-Female
  Cable to connect to a PC
- RTS and CTS not used.
- Title
- Size:
- Date:
- A4
- Number:
- Time:
- Revision:
- Sheet
- of
- File:

### Library data of the parts
C700-C704 = CAP: Capacitor; Fitted: True
C705 = CAP_POLAR: Polar Capacitor; Fitted: True
J700 = D Connector 9: Receptacle Assembly, 9 Position, Right Angle; Manufacturer: Generic Components; Package Information: Latest Revision: O; Positions: 9; Fitted: True; Published: 15-Jun-2001; Revision: July-2002: Re-released for DXP Platform.; Datasheet: (1-Sep-1999); Package Reference: 788750; Publisher: Altium Limited; Class I: Connector; Orientation: Right Angle; Gender: Receptacle
R700 = Res2: as R600 on sheet PCB_Power1D; Published: 8-Jun-2000; Revision: July-2002: Re-released for DXP Platform.; Publisher: Altium Limited; Class II: Resistor
U700 = ICL3225ECA: 3.0V TO 5.5V, Low-Power, up to 1Mbps, True RS-232 Transceiver Using Four 0.1µF External Capacitor; Fitted: TRUE

## Nets that join several sheets
5V: PCB_Power1D (6 pins), PortIO (JP400_PortIOD.27 JP400_PortIOD.29 JP400_PortIOD.31 JP400_PortIOD.33), PortIO (JP400_PortIOC.27 JP400_PortIOC.29 JP400_PortIOC.31 JP400_PortIOC.33), PortIO (JP400_PortIOB.27 JP400_PortIOB.29 JP400_PortIOB.31 JP400_PortIOB.33), PortIO (JP400_PortIOA.27 JP400_PortIOA.29 JP400_PortIOA.31 JP400_PortIOA.33), FPGA Symbol1 (C232.1 U200.14)
GND: PCB_Power1D (28 pins), PCB_JTAG1D (18 pins), PortIO (35 pins), PortIO (35 pins), PortIO (35 pins), PortIO (35 pins), FPGA Symbol1 (38 pins), FPGA Sheet1 (27 pins), PCB_RS2321D (7 pins)
VCCINT: PCB_Power1D (C603.1 C606.1 R601.2 U601.2), FPGA Symbol1 (14 pins), FPGA Sheet1 (12 pins)
VCCO: PCB_Power1D (C601.1 C604.1 R600.2 U600.2), PCB_JTAG1D (14 pins), PortIO (JP400_PortIOD.28 JP400_PortIOD.30 JP400_PortIOD.32 JP400_PortIOD.34), PortIO (JP400_PortIOC.28 JP400_PortIOC.30 JP400_PortIOC.32 JP400_PortIOC.34), PortIO (JP400_PortIOB.28 JP400_PortIOB.30 JP400_PortIOB.32 JP400_PortIOB.34), PortIO (JP400_PortIOA.28 JP400_PortIOA.30 JP400_PortIOA.32 JP400_PortIOA.34), FPGA Symbol1 (26 pins), FPGA Sheet1 (16 pins), PCB_RS2321D (7 pins)
CCLK: PCB_JTAG1D (U501.3), FPGA Sheet1 (U1.155)
CFG_DIN: PCB_JTAG1D (U501.1), FPGA Sheet1 (U1.153)
CFG_INIT: PCB_JTAG1D (RA500.2 U501.8), FPGA Sheet1 (U1.107)
CLK_BRD: FPGA Symbol1 (U201.2), FPGA Sheet1 (U1.182)
DONE: PCB_JTAG1D (R500.2 U501.10), FPGA Sheet1 (U1.104)
INA0: PortIO (RA401_PortIOA.5 RA402_PortIOA.8), FPGA Sheet1 (U1.154)
INA1: PortIO (RA401_PortIOA.6 RA402_PortIOA.7), FPGA Sheet1 (U1.152)
INA2: PortIO (RA401_PortIOA.7 RA402_PortIOA.6), FPGA Sheet1 (U1.151)
INA3: PortIO (RA401_PortIOA.8 RA402_PortIOA.5), FPGA Sheet1 (U1.150)
INA4: PortIO (RA404_PortIOA.8 RA406_PortIOA.5), FPGA Sheet1 (U1.149)
INA5: PortIO (RA404_PortIOA.7 RA406_PortIOA.6), FPGA Sheet1 (U1.148)
INA6: PortIO (RA404_PortIOA.6 RA406_PortIOA.7), FPGA Sheet1 (U1.147)
INA7: PortIO (RA404_PortIOA.5 RA406_PortIOA.8), FPGA Sheet1 (U1.146)
INA8: PortIO (RA403_PortIOA.8 RA407_PortIOA.5), FPGA Sheet1 (U1.145)
INA9: PortIO (RA403_PortIOA.7 RA407_PortIOA.6), FPGA Sheet1 (U1.141)
INA10: PortIO (RA403_PortIOA.6 RA407_PortIOA.7), FPGA Sheet1 (U1.140)
INA11: PortIO (RA403_PortIOA.5 RA407_PortIOA.8), FPGA Sheet1 (U1.139)
INA12: PortIO (RA400_PortIOA.5 RA405_PortIOA.8), FPGA Sheet1 (U1.138)
INA13: PortIO (RA400_PortIOA.6 RA405_PortIOA.7), FPGA Sheet1 (U1.136)
INA14: PortIO (RA400_PortIOA.7 RA405_PortIOA.6), FPGA Sheet1 (U1.135)
INA15: PortIO (RA400_PortIOA.8 RA405_PortIOA.5), FPGA Sheet1 (U1.134)
INA16: PortIO (R401_PortIOA.2 R402_PortIOA.1), FPGA Sheet1 (U1.133)
INB0: PortIO (RA401_PortIOB.5 RA402_PortIOB.8), FPGA Sheet1 (U1.206)
INB1: PortIO (RA401_PortIOB.6 RA402_PortIOB.7), FPGA Sheet1 (U1.205)
INB2: PortIO (RA401_PortIOB.7 RA402_PortIOB.6), FPGA Sheet1 (U1.204)
INB3: PortIO (RA401_PortIOB.8 RA402_PortIOB.5), FPGA Sheet1 (U1.203)
INB4: PortIO (RA404_PortIOB.8 RA406_PortIOB.5), FPGA Sheet1 (U1.202)
INB5: PortIO (RA404_PortIOB.7 RA406_PortIOB.6), FPGA Sheet1 (U1.201)
INB6: PortIO (RA404_PortIOB.6 RA406_PortIOB.7), FPGA Sheet1 (U1.200)
INB7: PortIO (RA404_PortIOB.5 RA406_PortIOB.8), FPGA Sheet1 (U1.199)
INB8: PortIO (RA403_PortIOB.8 RA407_PortIOB.5), FPGA Sheet1 (U1.198)
INB9: PortIO (RA403_PortIOB.7 RA407_PortIOB.6), FPGA Sheet1 (U1.194)
INB10: PortIO (RA403_PortIOB.6 RA407_PortIOB.7), FPGA Sheet1 (U1.193)
INB11: PortIO (RA403_PortIOB.5 RA407_PortIOB.8), FPGA Sheet1 (U1.192)
INB12: PortIO (RA400_PortIOB.5 RA405_PortIOB.8), FPGA Sheet1 (U1.191)
INB13: PortIO (RA400_PortIOB.6 RA405_PortIOB.7), FPGA Sheet1 (U1.189)
INB14: PortIO (RA400_PortIOB.7 RA405_PortIOB.6), FPGA Sheet1 (U1.188)
INB15: PortIO (RA400_PortIOB.8 RA405_PortIOB.5), FPGA Sheet1 (U1.187)
INB16: PortIO (R401_PortIOB.2 R402_PortIOB.1), FPGA Sheet1 (U1.185)
INC0: PortIO (RA401_PortIOC.5 RA402_PortIOC.8), FPGA Sheet1 (U1.48)
INC1: PortIO (RA401_PortIOC.6 RA402_PortIOC.7), FPGA Sheet1 (U1.47)
INC2: PortIO (RA401_PortIOC.7 RA402_PortIOC.6), FPGA Sheet1 (U1.46)
INC3: PortIO (RA401_PortIOC.8 RA402_PortIOC.5), FPGA Sheet1 (U1.45)
INC4: PortIO (RA404_PortIOC.8 RA406_PortIOC.5), FPGA Sheet1 (U1.44)
INC5: PortIO (RA404_PortIOC.7 RA406_PortIOC.6), FPGA Sheet1 (U1.43)
INC6: PortIO (RA404_PortIOC.6 RA406_PortIOC.7), FPGA Sheet1 (U1.42)
INC7: PortIO (RA404_PortIOC.5 RA406_PortIOC.8), FPGA Sheet1 (U1.41)
INC8: PortIO (RA403_PortIOC.8 RA407_PortIOC.5), FPGA Sheet1 (U1.40)
INC9: PortIO (RA403_PortIOC.7 RA407_PortIOC.6), FPGA Sheet1 (U1.36)
INC10: PortIO (RA403_PortIOC.6 RA407_PortIOC.7), FPGA Sheet1 (U1.35)
INC11: PortIO (RA403_PortIOC.5 RA407_PortIOC.8), FPGA Sheet1 (U1.34)
INC12: PortIO (RA400_PortIOC.5 RA405_PortIOC.8), FPGA Sheet1 (U1.33)
INC13: PortIO (RA400_PortIOC.6 RA405_PortIOC.7), FPGA Sheet1 (U1.31)
INC14: PortIO (RA400_PortIOC.7 RA405_PortIOC.6), FPGA Sheet1 (U1.30)
INC15: PortIO (RA400_PortIOC.8 RA405_PortIOC.5), FPGA Sheet1 (U1.29)
INC16: PortIO (R401_PortIOC.2 R402_PortIOC.1), FPGA Sheet1 (U1.27)
IND0: PortIO (RA401_PortIOD.5 RA402_PortIOD.8), FPGA Sheet1 (U1.101)
IND1: PortIO (RA401_PortIOD.6 RA402_PortIOD.7), FPGA Sheet1 (U1.98)
IND2: PortIO (RA401_PortIOD.7 RA402_PortIOD.6), FPGA Sheet1 (U1.97)
IND3: PortIO (RA401_PortIOD.8 RA402_PortIOD.5), FPGA Sheet1 (U1.96)
IND4: PortIO (RA404_PortIOD.8 RA406_PortIOD.5), FPGA Sheet1 (U1.95)
IND5: PortIO (RA404_PortIOD.7 RA406_PortIOD.6), FPGA Sheet1 (U1.94)
IND6: PortIO (RA404_PortIOD.6 RA406_PortIOD.7), FPGA Sheet1 (U1.93)
IND7: PortIO (RA404_PortIOD.5 RA406_PortIOD.8), FPGA Sheet1 (U1.89)
IND8: PortIO (RA403_PortIOD.8 RA407_PortIOD.5), FPGA Sheet1 (U1.88)
IND9: PortIO (RA403_PortIOD.7 RA407_PortIOD.6), FPGA Sheet1 (U1.87)
IND10: PortIO (RA403_PortIOD.6 RA407_PortIOD.7), FPGA Sheet1 (U1.86)
IND11: PortIO (RA403_PortIOD.5 RA407_PortIOD.8), FPGA Sheet1 (U1.84)
IND12: PortIO (RA400_PortIOD.5 RA405_PortIOD.8), FPGA Sheet1 (U1.83)
IND13: PortIO (RA400_PortIOD.6 RA405_PortIOD.7), FPGA Sheet1 (U1.82)
IND14: PortIO (RA400_PortIOD.7 RA405_PortIOD.6), FPGA Sheet1 (U1.81)
IND15: PortIO (RA400_PortIOD.8 RA405_PortIOD.5), FPGA Sheet1 (U1.80)
IND16: PortIO (R401_PortIOD.2 R402_PortIOD.1), FPGA Sheet1 (U1.77)
JTAG_NEXUS_TCK: PCB_JTAG1D (RA503.2 RA505.3), FPGA Sheet1 (U1.160)
JTAG_NEXUS_TDI: PCB_JTAG1D (RA503.3 RA505.1), FPGA Sheet1 (U1.102)
JTAG_NEXUS_TDO: PCB_JTAG1D (RA505.2), FPGA Sheet1 (U1.100)
JTAG_NEXUS_TMS: PCB_JTAG1D (RA503.1 RA505.4), FPGA Sheet1 (U1.99)
OUTA0: PortIO (RA408_PortIOA.5), FPGA Sheet1 (U1.129)
OUTA1: PortIO (RA408_PortIOA.6), FPGA Sheet1 (U1.127)
OUTA2: PortIO (RA408_PortIOA.7), FPGA Sheet1 (U1.126)
OUTA3: PortIO (RA408_PortIOA.8), FPGA Sheet1 (U1.125)
OUTA4: PortIO (RA409_PortIOA.5), FPGA Sheet1 (U1.123)
OUTA5: PortIO (RA409_PortIOA.6), FPGA Sheet1 (U1.122)
OUTA6: PortIO (RA409_PortIOA.7), FPGA Sheet1 (U1.121)
OUTA7: PortIO (RA409_PortIOA.8), FPGA Sheet1 (U1.120)
OUTA8: PortIO (RA410_PortIOA.5), FPGA Sheet1 (U1.116)
OUTA9: PortIO (RA410_PortIOA.6), FPGA Sheet1 (U1.115)
OUTA10: PortIO (RA410_PortIOA.7), FPGA Sheet1 (U1.114)
OUTA11: PortIO (RA410_PortIOA.8), FPGA Sheet1 (U1.113)
OUTA12: PortIO (RA411_PortIOA.5), FPGA Sheet1 (U1.112)
OUTA13: PortIO (RA411_PortIOA.6), FPGA Sheet1 (U1.111)
OUTA14: PortIO (RA411_PortIOA.7), FPGA Sheet1 (U1.110)
OUTA15: PortIO (RA411_PortIOA.8), FPGA Sheet1 (U1.109)
OUTA16: PortIO (R403_PortIOA.1), FPGA Sheet1 (U1.108)
OUTB0: PortIO (RA408_PortIOB.5), FPGA Sheet1 (U1.181)
OUTB1: PortIO (RA408_PortIOB.6), FPGA Sheet1 (U1.180)
OUTB2: PortIO (RA408_PortIOB.7), FPGA Sheet1 (U1.179)
OUTB3: PortIO (RA408_PortIOB.8), FPGA Sheet1 (U1.178)
OUTB4: PortIO (RA409_PortIOB.5), FPGA Sheet1 (U1.176)
OUTB5: PortIO (RA409_PortIOB.6), FPGA Sheet1 (U1.175)
OUTB6: PortIO (RA409_PortIOB.7), FPGA Sheet1 (U1.174)
OUTB7: PortIO (RA409_PortIOB.8), FPGA Sheet1 (U1.173)
OUTB8: PortIO (RA410_PortIOB.5), FPGA Sheet1 (U1.169)
OUTB9: PortIO (RA410_PortIOB.6), FPGA Sheet1 (U1.168)
OUTB10: PortIO (RA410_PortIOB.7), FPGA Sheet1 (U1.167)
OUTB11: PortIO (RA410_PortIOB.8), FPGA Sheet1 (U1.166)
OUTB12: PortIO (RA411_PortIOB.5), FPGA Sheet1 (U1.165)
OUTB13: PortIO (RA411_PortIOB.6), FPGA Sheet1 (U1.164)
OUTB14: PortIO (RA411_PortIOB.7), FPGA Sheet1 (U1.163)
OUTB15: PortIO (RA411_PortIOB.8), FPGA Sheet1 (U1.162)
OUTB16: PortIO (R403_PortIOB.1), FPGA Sheet1 (U1.161)
OUTC0: PortIO (RA408_PortIOC.5), FPGA Sheet1 (U1.24)
OUTC1: PortIO (RA408_PortIOC.6), FPGA Sheet1 (U1.23)
OUTC2: PortIO (RA408_PortIOC.7), FPGA Sheet1 (U1.22)
OUTC3: PortIO (RA408_PortIOC.8), FPGA Sheet1 (U1.21)
OUTC4: PortIO (RA409_PortIOC.5), FPGA Sheet1 (U1.20)
OUTC5: PortIO (RA409_PortIOC.6), FPGA Sheet1 (U1.18)
OUTC6: PortIO (RA409_PortIOC.7), FPGA Sheet1 (U1.17)
OUTC7: PortIO (RA409_PortIOC.8), FPGA Sheet1 (U1.16)
OUTC8: PortIO (RA410_PortIOC.5), FPGA Sheet1 (U1.15)
OUTC9: PortIO (RA410_PortIOC.6), FPGA Sheet1 (U1.11)
OUTC10: PortIO (RA410_PortIOC.7), FPGA Sheet1 (U1.10)
OUTC11: PortIO (RA410_PortIOC.8), FPGA Sheet1 (U1.9)
OUTC12: PortIO (RA411_PortIOC.5), FPGA Sheet1 (U1.8)
OUTC13: PortIO (RA411_PortIOC.6), FPGA Sheet1 (U1.7)
OUTC14: PortIO (RA411_PortIOC.7), FPGA Sheet1 (U1.6)
OUTC15: PortIO (RA411_PortIOC.8), FPGA Sheet1 (U1.5)
OUTC16: PortIO (R403_PortIOC.1), FPGA Sheet1 (U1.4)
OUTD0: PortIO (RA408_PortIOD.5), FPGA Sheet1 (U1.74)
OUTD1: PortIO (RA408_PortIOD.6), FPGA Sheet1 (U1.73)
OUTD2: PortIO (RA408_PortIOD.7), FPGA Sheet1 (U1.71)
OUTD3: PortIO (RA408_PortIOD.8), FPGA Sheet1 (U1.70)
OUTD4: PortIO (RA409_PortIOD.5), FPGA Sheet1 (U1.69)
OUTD5: PortIO (RA409_PortIOD.6), FPGA Sheet1 (U1.68)
OUTD6: PortIO (RA409_PortIOD.7), FPGA Sheet1 (U1.64)
OUTD7: PortIO (RA409_PortIOD.8), FPGA Sheet1 (U1.63)
OUTD8: PortIO (RA410_PortIOD.5), FPGA Sheet1 (U1.62)
OUTD9: PortIO (RA410_PortIOD.6), FPGA Sheet1 (U1.61)
OUTD10: PortIO (RA410_PortIOD.7), FPGA Sheet1 (U1.60)
OUTD11: PortIO (RA410_PortIOD.8), FPGA Sheet1 (U1.59)
OUTD12: PortIO (RA411_PortIOD.5), FPGA Sheet1 (U1.58)
OUTD13: PortIO (RA411_PortIOD.6), FPGA Sheet1 (U1.57)
OUTD14: PortIO (RA411_PortIOD.7), FPGA Sheet1 (U1.56)
OUTD15: PortIO (RA411_PortIOD.8), FPGA Sheet1 (U1.55)
OUTD16: PortIO (R403_PortIOD.1), FPGA Sheet1 (U1.49)
PROGRAM: PCB_JTAG1D (RA500.1 U501.7), FPGA Sheet1 (U1.106)
RS232_RX: FPGA Sheet1 (U1.75), PCB_RS2321D (R700.2)
RS232_TX: FPGA Sheet1 (U1.3), PCB_RS2321D (U700.13)
TCK: PCB_JTAG1D (RA502.3 RA504.3 U500.13), FPGA Sheet1 (U1.207)
TDI: PCB_JTAG1D (U500.9), FPGA Sheet1 (U1.159)
TDO: PCB_JTAG1D (RA504.2), FPGA Sheet1 (U1.157)
TEST_BUTTON: FPGA Symbol1 (R200.1 SW200.1 SW200.2), FPGA Sheet1 (U1.132)
TMS: PCB_JTAG1D (RA502.2 RA504.4 U500.6), FPGA Sheet1 (U1.2)